# Altium schematic sheet design_21.SchDoc: design
size 414 x 279 mm; Date: 1/25/2021 11:39:22 PM; SheetNumber: 22; Origin: Eagle; GateName_1: G$1; SymbolName_1: A3-L-GUMSTIX; LibraryName: qualified_1; DeviceSetName: A3-L-GUMSTIX; A: A; B: B; C: C; D: D; E: E; F: F; G: G; H: H; 1: 1; 2: 2; 3: 3; 4: 4; 5: 5; Sheet: Sheet:; C:/Gumstix/gumstix-logo-16.bmp: C:/Gumstix/gumstix-logo-16.bmp; Board: Board:
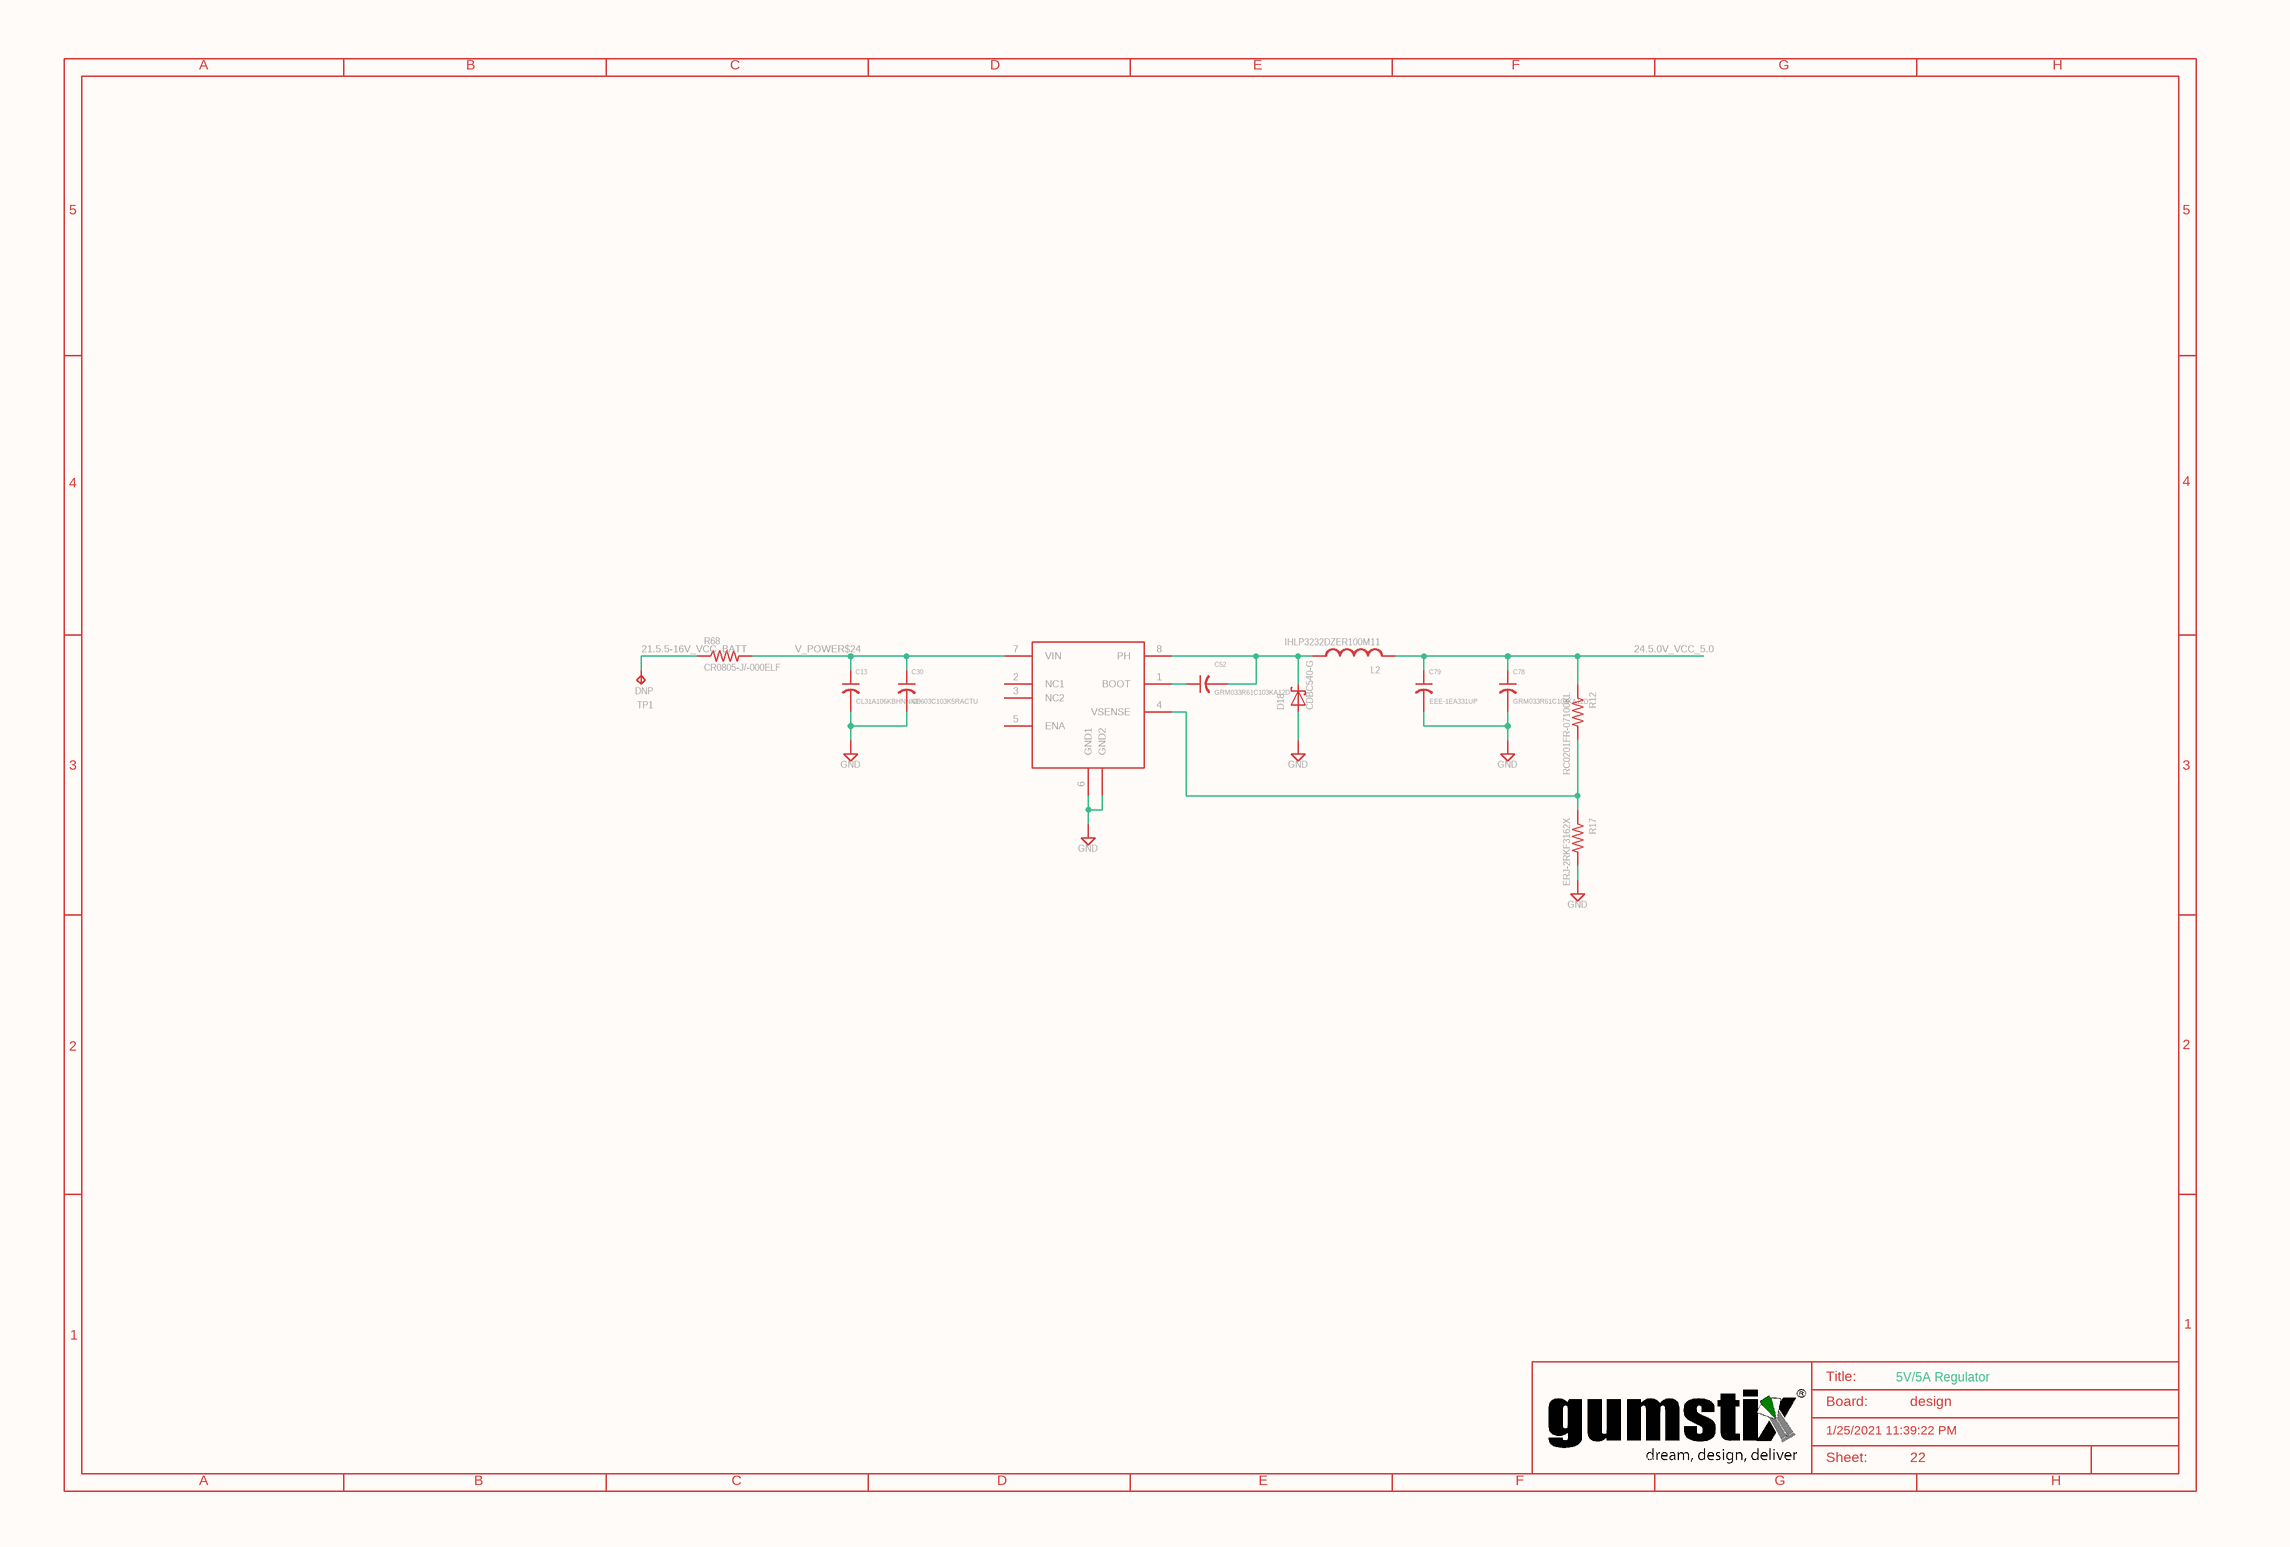
[diagram p0: design_21.SchDoc]

## Parts
C13  CL31A106KBHNNNE  [1206]
C30  C0603C103K5RACTU  [0603]
C52  GRM033R61C103KA12D  [0201]
C78  GRM033R61C103KA12D  [0201]
C79  EEE-1EA331UP  [PANASONIC_F]
D18  CDBC540-G  [DO-214AB]
L2  IHLP3232DZER100M11  [3232DZ]
R12  RC0201FR-07100KL  [0201]
R17  ERJ-2RKF3162X  [0402]
R68  CR0805-J/-000ELF  [0805]
SUPPLY24  GND
SUPPLY25  GND
SUPPLY26  GND
SUPPLY81  GND
SUPPLY82  GND
TP1  DNP  [TP0500]
U1  TPS5450QDDARQ1  [8SO_POWERPAD]  (value not drawn)

## Nets
21.5.5-16V_VCC_BATT: R68.1 TP1.1(TP)
24.5.0V_VCC_5.0: C78.1 C79.+ L2.2 R12.1
V_POWER$24: C13.1 C30.1 R68.2 U1.7(VIN)
NetC13_2: C13.2 C30.2 SUPPLY25.?1(GND)
NetC52_1: C52.1 U1.1(BOOT)
NetC52_2: C52.2 D18.C L2.1 U1.8(PH)
NetC78_2: C78.2 C79.- SUPPLY81.?1(GND)
NetD18_A: D18.A SUPPLY26.?1(GND)
NetR12_2: R12.2 R17.1 U1.4(VSENSE)
NetR17_2: R17.2 SUPPLY82.?1(GND)
NetSUPPLY24_?1: SUPPLY24.?1(GND) U1.6(GND1) U1.9_PWRPAD1_PWRPAD2_PWRPAD3_PWRPAD4_PWRPAD5_PWRPAD6_PWRPAD7_PWRPAD8(GND2)

Not connected (* = marked no-connect by the designer): U1 2(NC1) 3(NC2) 5(ENA)

## Notes on the sheet
- A
- B
- C
- D
- E
- F
- G
- H
- 5
- 4
- 3
- 2
- 1
- Title:
- Board:
- 5V/5A Regulator
- design
- C:/Gumstix/gumstix-logo-16.bmp
- 1/25/2021 11:39:22 PM
- Sheet:
- 22

## Library data of the parts
C13 = CL31A106KBHNNNE: GateName_1: G$1; SymbolName_1: C-US; LibraryName: qualified_1@eagle_src_repo_f26ba765df9be4aea4dc36b2b99244de1327d3cb; DeviceSetName: CL31A106KBHNNNE; HEIGHT: 0.51
C30 = C0603C103K5RACTU: GateName_1: G$1; SymbolName_1: C-US; LibraryName: qualified_1@eagle_src_repo_f26ba765df9be4aea4dc36b2b99244de1327d3cb; DeviceSetName: C0603C103K5RACTU; HEIGHT: 0.5
C52 C78 = GRM033R61C103KA12D: GateName_1: G$1; SymbolName_1: C-US; LibraryName: qualified_1@eagle_src_repo_f26ba765df9be4aea4dc36b2b99244de1327d3cb; DeviceSetName: GRM033R61C103KA12D; HEIGHT: 0.25
C79 = EEE-1EA331UP: GateName_1: G$1; SymbolName_1: C-US; LibraryName: qualified_1@eagle_src_repo_f26ba765df9be4aea4dc36b2b99244de1327d3cb; DeviceSetName: EEE-1EA331UP
D18 = CDBC540-G: Schottky Diode; GateName_1: G$1; SymbolName_1: SCHOTTKY; LibraryName: qualified_1; DeviceSetName: CDBC540-G
L2 = IHLP3232DZER100M11: GateName_1: G$1; SymbolName_1: L-US; LibraryName: qualified_1@eagle_src_repo_f26ba765df9be4aea4dc36b2b99244de1327d3cb; DeviceSetName: IHLP3232DZER100M11; DM: DM; DR: DR; DX: DX; DY: DY; SHEETNO: SHEETNO
R12 = RC0201FR-07100KL: GateName_1: G$1; SymbolName_1: R-US; LibraryName: qualified_1@eagle_src_repo_f26ba765df9be4aea4dc36b2b99244de1327d3cb; DeviceSetName: RC0201FR-07100KL; DM: DM; DR: DR; DX: DX; DY: DY; HEIGHT: 0.25; SHEETNO: SHEETNO
R17 = ERJ-2RKF3162X: GateName_1: G$1; SymbolName_1: R-US; LibraryName: qualified_1@eagle_src_repo_f26ba765df9be4aea4dc36b2b99244de1327d3cb; DeviceSetName: ERJ-2RKF3162X; DM: DM; DR: DR; DX: DX; DY: DY; HEIGHT: 0.35; SHEETNO: SHEETNO
R68 = CR0805-J/-000ELF: GateName_1: G$1; SymbolName_1: R-US; LibraryName: qualified_1@eagle_src_repo_f26ba765df9be4aea4dc36b2b99244de1327d3cb; DeviceSetName: CR0805-J/-000ELF; HEIGHT: 0.51
SUPPLY24-SUPPLY26 SUPPLY81 SUPPLY82 = GND: SUPPLY SYMBOL; GateName_1: GND; SymbolName_1: GND; LibraryName: supply2; DeviceSetName: GND
TP1 = TP05: GateName_1: G$1; SymbolName_1: TP; DeviceName: 05; LibraryName: qualified_1; DeviceSetName: TP; HEIGHT: 0
U1 = TPS5450QDDARQ1: GateName_1: G$1; SymbolName_1: TPS5450; LibraryName: qualified_1; DeviceSetName: TPS5450QDDARQ1